# EAGLE design Queen Schematic Headers 2 (EAGLE 8.6.3)
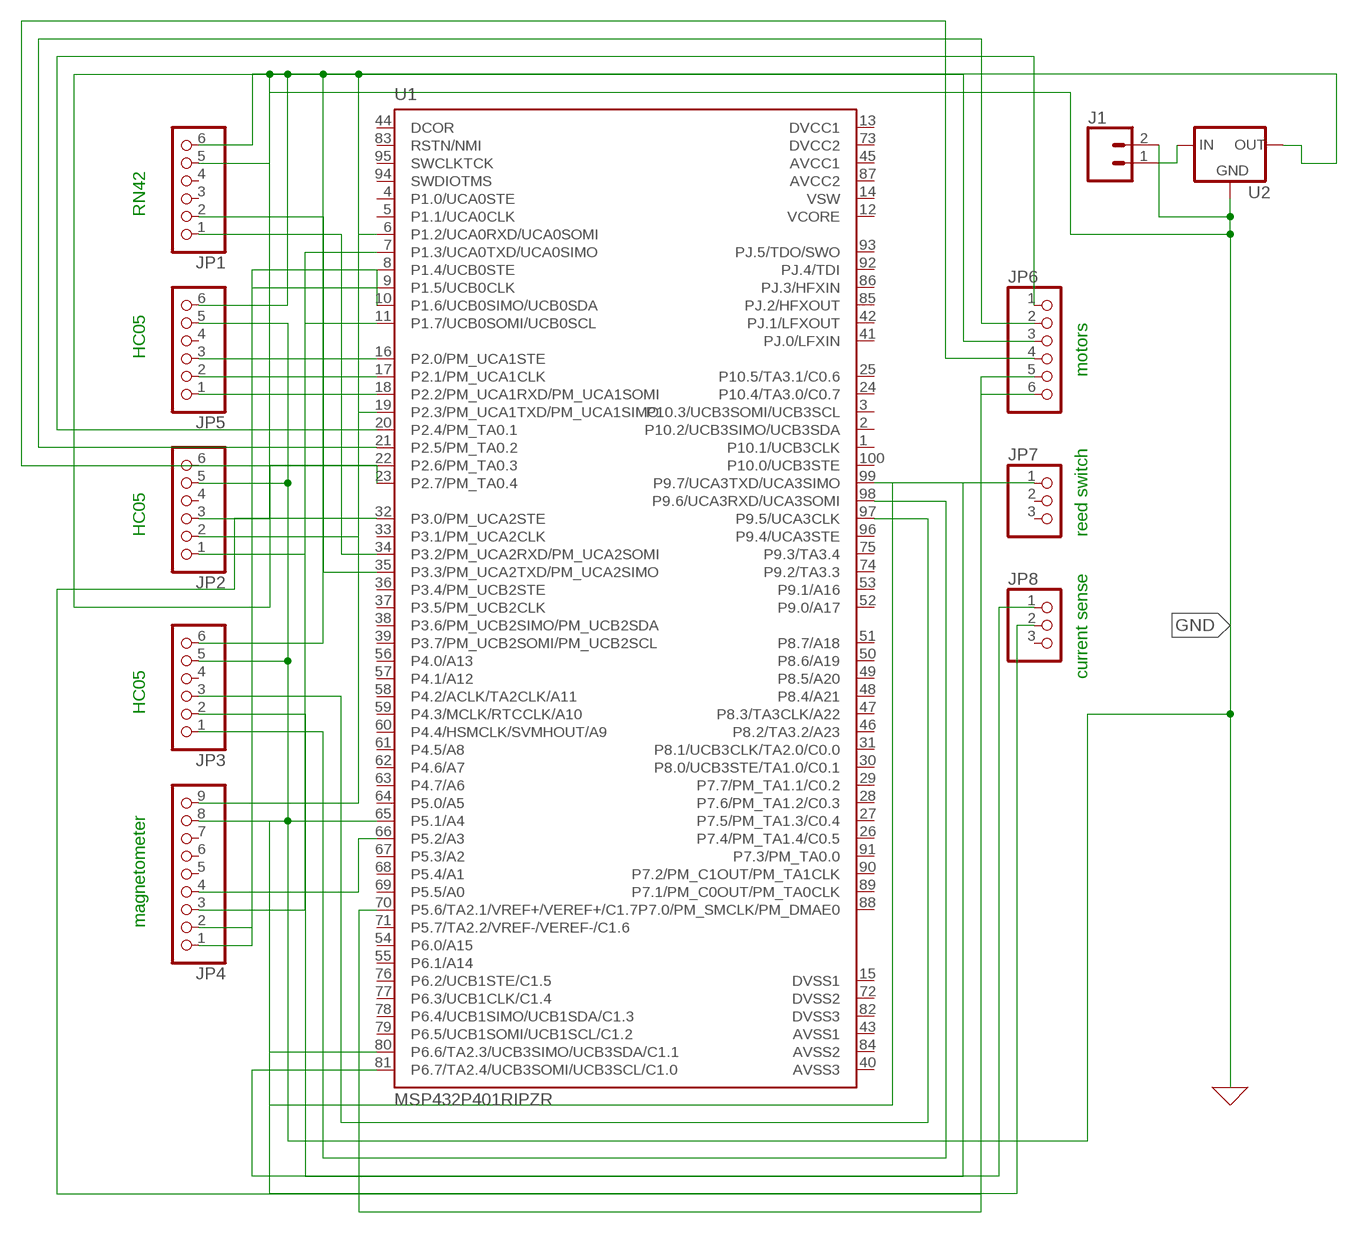
[diagram p0: schematic, sheet 1]

## Parts
J1  CONN_025MM  [SCREWTERMINAL-5MM-2]
JP1  PINHD-1X6  [1X06]
JP2  PINHD-1X6  [1X06]
JP3  PINHD-1X6  [1X06]
JP4  PINHD-1X9  [1X09-BIG]
JP5  PINHD-1X6  [1X06]
JP6  PINHD-1X6  [1X06]
JP7  PINHD-1X3  [1X03]
JP8  PINHD-1X3  [1X03]
U1  MSP432P401RIPZR  [QFP50P1600X1600X160-100N]
U2  V_REG_78XXSINK  [TO220-IGO]

## Nets
GND: J1.2 JP1.5 JP2.5 JP3.5 JP4.8 JP5.5 U2.GND
N$1: JP1.6 JP2.6 JP3.6 JP4.9 JP5.6 U2.OUT
N$2: JP1.1 U1.34(P3.2/PM_UCA2RXD/PM_UCA2SOMI)
N$3: JP1.2 U1.35(P3.3/PM_UCA2TXD/PM_UCA2SIMO)
N$4: JP3.2 U1.99(P9.7/UCA3TXD/UCA3SIMO)
N$5: JP5.1 U1.6(P1.2/UCA0RXD/UCA0SOMI)
N$6: JP5.2 U1.7(P1.3/UCA0TXD/UCA0SIMO)
N$7: JP5.3 U1.16(P2.0/PM_UCA1STE)
N$8: JP3.3 U1.97(P9.5/UCA3CLK)
N$9: JP2.1 U1.18(P2.2/PM_UCA1RXD/PM_UCA1SOMI)
N$10: JP2.2 U1.19(P2.3/PM_UCA1TXD/PM_UCA1SIMO)
N$11: JP2.3 U1.17(P2.1/PM_UCA1CLK)
N$12: JP4.1 U1.9(P1.5/UCB0CLK)
N$13: JP3.1 U1.98(P9.6/UCA3RXD/UCA3SOMI)
N$14: JP4.2 U1.10(P1.6/UCB0SIMO/UCB0SDA)
N$15: JP4.3 U1.11(P1.7/UCB0SOMI/UCB0SCL)
N$16: JP4.4 U1.66(P5.2/A3)
N$17: JP6.1 U1.20(P2.4/PM_TA0.1)
N$18: J1.1 U2.IN
N$19: JP6.2 U1.21(P2.5/PM_TA0.2)
N$20: JP6.3 U1.22(P2.6/PM_TA0.3)
N$21: JP6.4 U1.23(P2.7/PM_TA0.4)
N$22: JP6.5 U1.32(P3.0/PM_UCA2STE)
N$23: JP6.6 U1.70(P5.6/TA2.1/VREF+/VEREF+/C1.7)
N$24: JP7.1 U1.80(P6.6/TA2.3/UCB3SIMO/UCB3SDA/C1.1)
N$25: JP8.1 U1.81(P6.7/TA2.4/UCB3SOMI/UCB3SCL/C1.0)
N$26: JP8.2 U1.65(P5.1/A4)
Unconnected: JP1.3 JP1.4 JP2.4 JP3.4 JP4.5 JP4.6 JP4.7 JP5.4 JP7.2 JP7.3 JP8.3 U1.1(P10.1/UCB3CLK) U1.2(P10.2/UCB3SIMO/UCB3SDA) U1.3(P10.3/UCB3SOMI/UCB3SCL) U1.4(P1.0/UCA0STE) U1.5(P1.1/UCA0CLK) U1.8(P1.4/UCB0STE) U1.24(P10.4/TA3.0/C0.7) U1.25(P10.5/TA3.1/C0.6) U1.26(P7.4/PM_TA1.4/C0.5) U1.27(P7.5/PM_TA1.3/C0.4) U1.28(P7.6/PM_TA1.2/C0.3) U1.29(P7.7/PM_TA1.1/C0.2) U1.30(P8.0/UCB3STE/TA1.0/C0.1) U1.31(P8.1/UCB3CLK/TA2.0/C0.0) U1.33(P3.1/PM_UCA2CLK) U1.36(P3.4/PM_UCB2STE) U1.37(P3.5/PM_UCB2CLK) U1.38(P3.6/PM_UCB2SIMO/PM_UCB2SDA) U1.39(P3.7/PM_UCB2SOMI/PM_UCB2SCL) U1.41(PJ.0/LFXIN) U1.42(PJ.1/LFXOUT) U1.44(DCOR) U1.46(P8.2/TA3.2/A23) U1.47(P8.3/TA3CLK/A22) U1.48(P8.4/A21) U1.49(P8.5/A20) U1.50(P8.6/A19) U1.51(P8.7/A18) U1.52(P9.0/A17) U1.53(P9.1/A16) U1.54(P6.0/A15) U1.55(P6.1/A14) U1.56(P4.0/A13) U1.57(P4.1/A12) U1.58(P4.2/ACLK/TA2CLK/A11) U1.59(P4.3/MCLK/RTCCLK/A10) U1.60(P4.4/HSMCLK/SVMHOUT/A9) U1.61(P4.5/A8) U1.62(P4.6/A7) U1.63(P4.7/A6) U1.64(P5.0/A5) U1.67(P5.3/A2) U1.68(P5.4/A1) U1.69(P5.5/A0) U1.71(P5.7/TA2.2/VREF-/VEREF-/C1.6) U1.74(P9.2/TA3.3) U1.75(P9.3/TA3.4) U1.76(P6.2/UCB1STE/C1.5) U1.77(P6.3/UCB1CLK/C1.4) U1.78(P6.4/UCB1SIMO/UCB1SDA/C1.3) U1.79(P6.5/UCB1SOMI/UCB1SCL/C1.2) U1.83(RSTN/NMI) U1.85(PJ.2/HFXOUT) U1.86(PJ.3/HFXIN) U1.88(P7.0/PM_SMCLK/PM_DMAE0) U1.89(P7.1/PM_C0OUT/PM_TA0CLK) U1.90(P7.2/PM_C1OUT/PM_TA1CLK) U1.91(P7.3/PM_TA0.0) U1.92(PJ.4/TDI) U1.93(PJ.5/TDO/SWO) U1.94(SWDIOTMS) U1.95(SWCLKTCK) U1.96(P9.4/UCA3STE) U1.100(P10.0/UCB3STE)

## Notes on the sheet
- RN42
- HC05
- motors
- HC05 | reed switch
- current sense
- HC05
- magnetometer

## Power pins joined to a net without a drawn wire
AVCC1: U1.45(AVCC1)
AVCC2: U1.87(AVCC2)
AVSS1: U1.43(AVSS1)
AVSS2: U1.84(AVSS2)
AVSS3: U1.40(AVSS3)
DVCC1: U1.13(DVCC1)
DVCC2: U1.73(DVCC2)
DVSS1: U1.15(DVSS1)
DVSS2: U1.72(DVSS2)
DVSS3: U1.82(DVSS3)
VCORE: U1.12(VCORE)
VSW: U1.14(VSW)

## Library data of the parts
J1 = SparkFun-Connectors:CONN_02: Multi connection point. Often used as Generic Header-pin footprint for 0.1 inch spaced/style header connections On any of the 0.1 inch spaced packages, you can populate with these: Break Away Headers - Straight <https://www.sparkfun.com/products/116> (PRT-00116) Break Away Male Headers - Right Angle <https://www.sparkfun.com/products/553> (PRT-00553) Female Headers <https://www.sparkfun.com/products/115> (PRT-00115) Break Away Headers - Machine Pin <https://www.sparkfun.com/products/117> (PRT-00117) Break Away Female Headers - Swiss Machine Pin <https://www.sparkfun.com/products/743> (PRT-00743) For SCREWTERMINALS and SPRING TERMINALS visit here: Screw Terimnals on SparkFun.com <https://www.sparkfun.com/search/results?term=Screw+Terminals> (5mm/3.5mm/2.54mm spacing) This device is also useful as a general connection point to wire up your design to another part of your project. Our various solder wires solder well into these plated through hole pads. Hook-Up Wire - Assortment (Stranded, 22 AWG) <https://www.sparkfun.com/products/11375> (PRT-11375) Hook-Up Wire - Assortment (Solid Core, 22 AWG) <https://www.sparkfun.com/products/11367> (PRT-11367) View the entire wire category on our website here <https://www.sparkfun.com/categories/141> Special notes: Molex polarized connector foot print use with: PRT-08233 with associated crimp pins and housings. 2.54_SCREWTERM for use with PRT-10571. 3.5mm Screw Terminal footprints for PRT-08084 5mm Screw Terminal footprints for use with PRT-08432; SF_SKU: PRT-08432
JP1-JP3 JP5 JP6 = adafruit:PINHD-1X6: PIN HEADER
JP4 = adafruit:PINHD-1X9: Pin header 1x10 0.1" spacing With round pins
JP7 JP8 = adafruit:PINHD-1X3: PIN HEADER
U1 = MSP432P401RIPZR:MSP432P401RIPZR: Low-Power and High Performance 32-Bit ARM Cortex M4F With 256KB Flash and 64KB RAM 100-LQFP -40 to 85; AVAILABILITY: Good; DESCRIPTION: Low-Power and High Performance 32-Bit ARM Cortex M4F With 256KB Flash and 64KB RAM 100-LQFP -40 to 85; MF: Texas Instruments; MP: MSP432P401RIPZR; PACKAGE: LQFP-100 Texas Instruments; PRICE: 5.54 USD
U2 = SparkFun-IC-Power:V_REG_78XX: Voltage Regulator Standard 78xx regulator. IGO (Input Ground Output). Spark Fun Electronics SKU : COM-00107

## Board
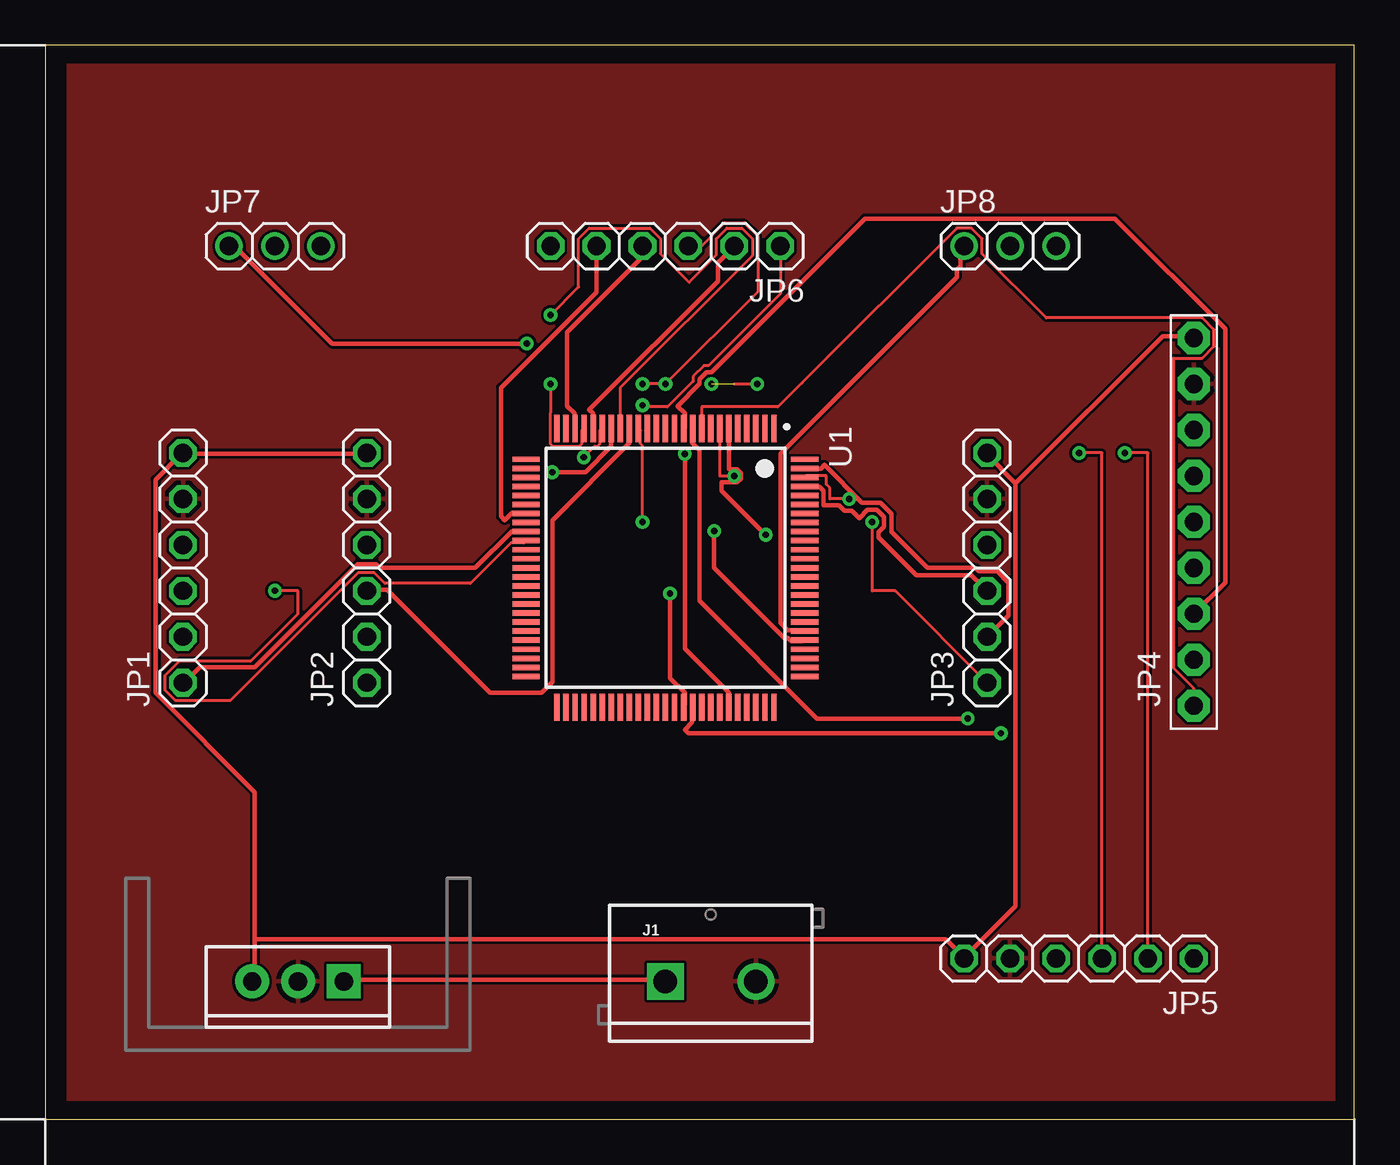
[diagram p1: board, top side]
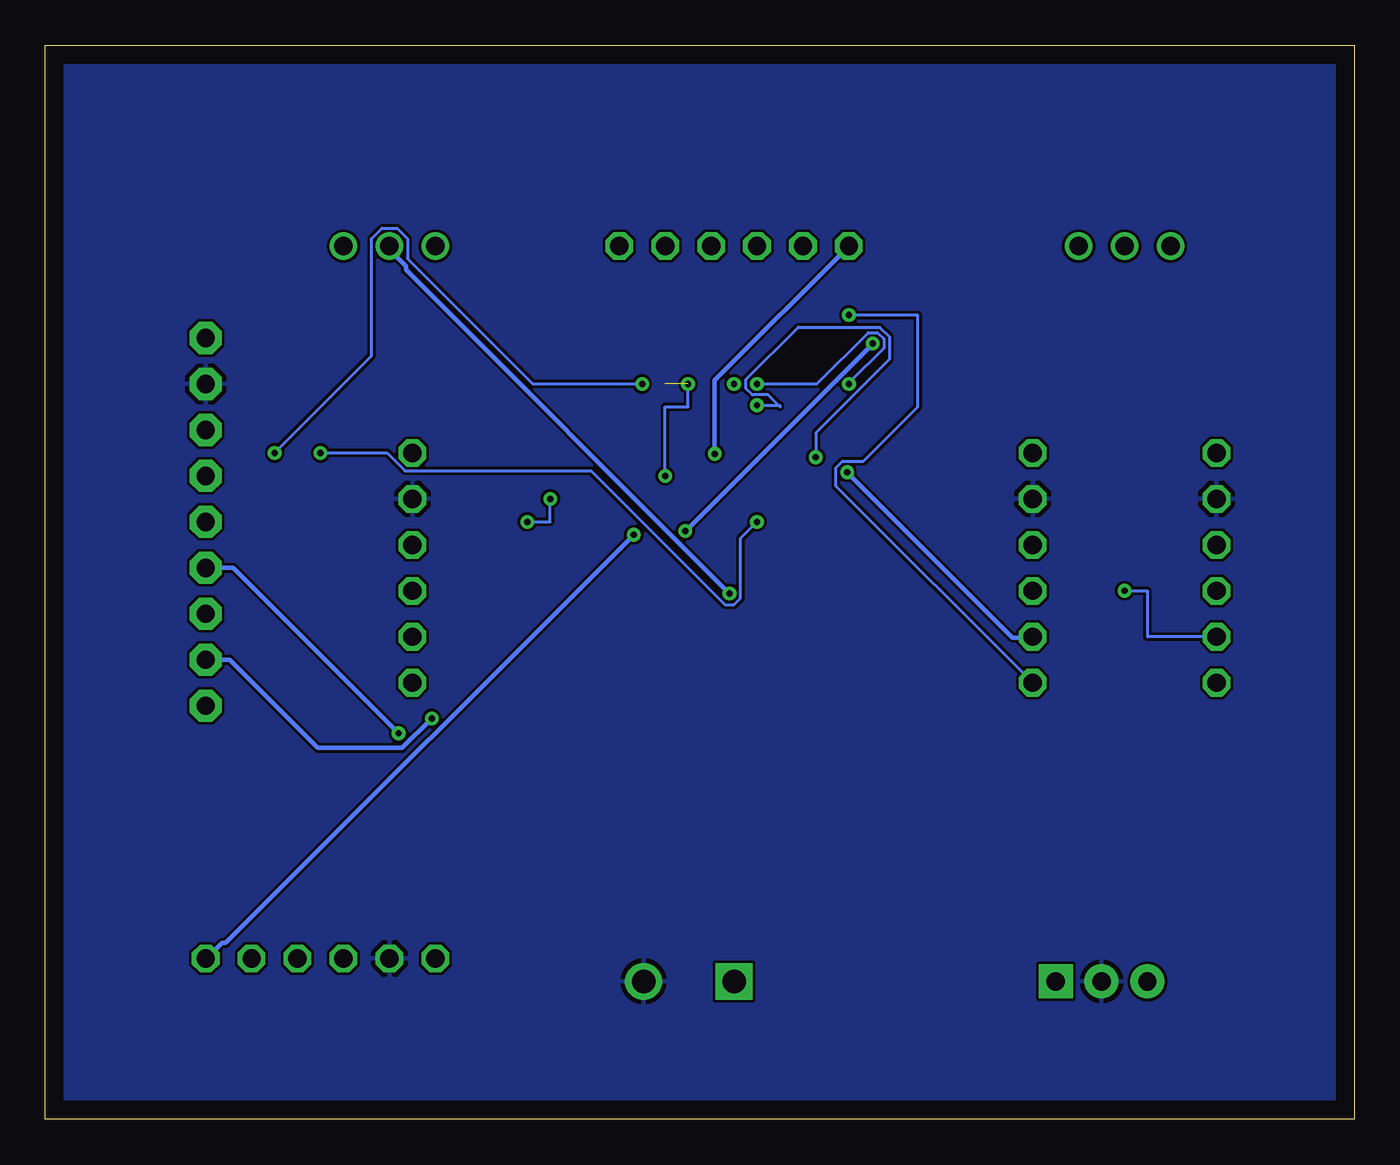
[diagram p2: board, bottom side, seen from below]

Size 72.37 x 59.36 mm. Coordinates in mm from the lower left corner, seen from the top.
Outline: 0,0 72.37,0 72.37,59.36 0,59.36 0,0
Copper layers (1*16): Top 0.035mm / dielectric 1.5mm / Bottom 0.035mm
Design rules "default *": minimum track width 10mil, minimum drill 0.35mm, track to track 6mil, track to pad 6mil, pad to pad 6mil, via to via 6mil, smd to smd 6mil, copper to edge 40mil, drill to drill 6mil, minimum pad ring 10mil, minimum via ring 8mil, stop-mask expansion 4mil, vias tented up to drill 0mil, thermal gap 10mil

### Footprints (pad centres in the part's own frame; a part is rotated, then mirrored left to right if it is on the bottom)
SCREWTERMINAL-5MM-2 = drill 1.3 pad 2.032 square: 1 0,0 | drill 1.3 pad 2.032: 2 5,0
1X06 = drill 1.016 octagon: 1 -6.35,0; 2 -3.81,0; 3 -1.27,0; 4 1.27,0; 5 3.81,0; 6 6.35,0
1X09-BIG = drill 1.016 pad 1.778 octagon: 1 -10.16,0; 2 -7.62,0; 3 -5.08,0; 4 -2.54,0; 5 0,0; 6 2.54,0; 7 5.08,0; 8 7.62,0; 9 10.16,0
1X03 = drill 1.016: 1 -2.54,0; 2 0,0; 3 2.54,0
QFP50P1600X1600X160-100N = smd 1.5 x 0.3: 1 -7.7,6; 2 -7.7,5.5; 3 -7.7,5; 4 -7.7,4.5; 5 -7.7,4; 6 -7.7,3.5; 7 -7.7,3; 8 -7.7,2.5; 9 -7.7,2; 10 -7.7,1.5; 11 -7.7,1; 12 -7.7,0.5; 13 -7.7,0; 14 -7.7,-0.5; 15 -7.7,-1; 16 -7.7,-1.5; 17 -7.7,-2; 18 -7.7,-2.5; 19 -7.7,-3; 20 -7.7,-3.5; 21 -7.7,-4; 22 -7.7,-4.5; 23 -7.7,-5; 24 -7.7,-5.5; 25 -7.7,-6; 51 7.7,-6; 52 7.7,-5.5; 53 7.7,-5; 54 7.7,-4.5; 55 7.7,-4; 56 7.7,-3.5; 57 7.7,-3; 58 7.7,-2.5; 59 7.7,-2; 60 7.7,-1.5; 61 7.7,-1; 62 7.7,-0.5; 63 7.7,0; 64 7.7,0.5; 65 7.7,1; 66 7.7,1.5; 67 7.7,2; 68 7.7,2.5; 69 7.7,3; 70 7.7,3.5; 71 7.7,4; 72 7.7,4.5; 73 7.7,5; 74 7.7,5.5; 75 7.7,6 | smd 0.3 x 1.5: 26 -6,-7.7; 27 -5.5,-7.7; 28 -5,-7.7; 29 -4.5,-7.7; 30 -4,-7.7; 31 -3.5,-7.7; 32 -3,-7.7; 33 -2.5,-7.7; 34 -2,-7.7; 35 -1.5,-7.7; 36 -1,-7.7; 37 -0.5,-7.7; 38 0,-7.7; 39 0.5,-7.7; 40 1,-7.7; 41 1.5,-7.7; 42 2,-7.7; 43 2.5,-7.7; 44 3,-7.7; 45 3.5,-7.7; 46 4,-7.7; 47 4.5,-7.7; 48 5,-7.7; 49 5.5,-7.7; 50 6,-7.7; 76 6,7.7; 77 5.5,7.7; 78 5,7.7; 79 4.5,7.7; 80 4,7.7; 81 3.5,7.7; 82 3,7.7; 83 2.5,7.7; 84 2,7.7; 85 1.5,7.7; 86 1,7.7; 87 0.5,7.7; 88 0,7.7; 89 -0.5,7.7; 90 -1,7.7; 91 -1.5,7.7; 92 -2,7.7; 93 -2.5,7.7; 94 -3,7.7; 95 -3.5,7.7; 96 -4,7.7; 97 -4.5,7.7; 98 -5,7.7; 99 -5.5,7.7; 100 -6,7.7
TO220-IGO = drill 1 pad 1.88: GND 0,0; OUT 2.54,0 | drill 1 pad 1.88 square: IN -2.54,0

### Placement (x,y rotation side)
J1  34.29,7.62 0 top
JP1  7.62,30.48 90 top
JP2  17.78,30.48 90 top
JP3  52.07,30.48 90 top
JP4  63.5,33.02 90 top
JP5  57.15,8.89 180 top
JP6  34.29,48.26 180 top
JP7  12.7,48.26 0 top
JP8  53.34,48.26 0 top
U1  34.29,30.48 270 top
U2  13.97,7.62 180 top

### Tracks (layer width: path | path; a pad name or v marks a point on that pad's centre or on a via)
GND
  pour Bottom: 0,59.69 72.39,59.69 72.39,0 0,0
  pour Bottom: 1.27,59.69 73.66,59.69 73.66,0 1.27,0
  pour Top: 1.27,59.69 73.66,59.69 73.66,0 1.27,0
N$1
  Top 0.254: JP2.6 17.68,36.78 7.72,36.78 JP1.6 7.52,36.78 6.1,35.36 6.1,23.57 11.58,18.09 11.58,9.96 | 11.58,9.96 11.58,7.72 U2.OUT | 50.8,8.94 53.65,11.79 53.65,35.15 | 53.65,35.15 52.02,36.78 JP3.6 | 53.65,35.15 61.77,43.28 63.4,43.28 JP4.9 | 11.58,9.96 49.78,9.96 50.8,8.94 | 50.8,8.94 JP5.6
N$2
  Top 0.254: U1.34 26.42,32.51 25.81,32.51 23.77,30.48 18.49,30.48 18.29,30.68 17.27,30.68 11.58,24.99 8.53,24.99 7.72,24.18 JP1.1
N$3  (via drill 0.35)
  Top 0.152: U1.35 26.47,31.86 25.75,31.86 23.5,29.62 18.77,29.62 18.19,30.2 17.29,30.2 10.23,23.14 7.21,23.14 6.63,23.72 6.63,24.54 7.44,25.35 11.38,25.35 13.97,27.94 13.97,29.21 v12.7,29.21
  Bottom 0.152: JP1.2 11.43,26.67 11.43,29.21 v12.7,29.21
N$4
  Top 0.254: JP3.2 53.24,27.84 53.24,29.67 52.63,30.28 51.61,30.28 51.41,30.48 48.77,30.48 46.78,32.46 46.78,33.46 46.16,34.08 45.16,34.08 43.08,36.17 42.88,35.97 42.06,35.97 U1.99
N$5  (via drill 0.35)
  Top 0.254: v39.83,32.31 37.39,34.75 37.39,35.2 38.25,35.2 38.46,35.41 38.46,35.71 38.25,35.92 37.8,35.92 37.8,38 U1.6
  Bottom 0.254: v39.83,32.31 62.38,9.75 62.59,9.75 63.4,8.94 JP5.1
N$6  (via drill 0.35)  (1 unrouted)
  Top 0.152: JP5.2 60.96,36.83 v59.69,36.83 | 38.1,40.64 v39.37,40.64 | U1.7 37.29,35.56 v38.1,35.56
  Bottom 0.152: v59.69,36.83 54.33,42.19 54.33,48.67 53.75,49.25 52.93,49.25 52.35,48.67 52.35,47.57 45.42,40.64 v39.37,40.64 | v38.1,35.56 38.1,39.37 36.83,39.37 v36.83,40.64
N$7  (via drill 0.35)
  Top 0.152: JP5.3 58.42,36.83 v57.15,36.83 | v33.02,33.02 33.02,37.23 32.91,37.34 32.91,38.06 U1.16
  Bottom 0.152: v57.15,36.83 53.47,36.83 52.48,35.84 42.18,35.84 34.8,28.45 34.29,28.45 33.94,28.81 33.94,32.1 v33.02,33.02
N$8
  Top 0.254: JP3.3 51.21,30.07 48.16,30.07 46.08,32.16 46.08,32.45 46.38,32.75 46.38,33.29 45.99,33.68 45.45,33.68 45,33.23 44.6,33.63 44.18,33.63 43.88,33.93 43.03,33.93 43.02,33.95 43.02,34.75 42.81,34.95 42.06,34.95 U1.97
N$9  (via drill 0.35)
  Top 0.152: U1.18 31.79,40.43 39.09,47.73 39.09,48.67 38.51,49.25 37.69,49.25 37.11,48.67 37.11,47.77 35.6,46.26 34.01,47.85 34.01,48.67 33.43,49.25 30.07,49.25 29.49,48.67 29.49,46 v27.94,44.45
  Bottom 0.152: JP2.1 28.65,35 28.65,36.02 28.29,36.37 27.13,36.37 24.13,39.37 24.13,44.45 v27.94,44.45
N$10  (via drill 0.35)
  Top 0.254: v28.04,35.76 29.87,35.76 31.29,37.19 31.29,38 U1.19
  Bottom 0.254: v28.04,35.76 18.9,26.62 17.88,26.62 JP2.2
N$11
  Top 0.254: U1.17 32.31,38 32.31,37.39 28.04,33.12 28.04,24.18 27.43,23.57 24.59,23.57 18.9,29.26 17.88,29.26 JP2.3
N$12
  Top 0.152: JP4.1 63.5,23.82 62.38,24.94 62.38,42.06 63.96,42.06 64.62,42.72 64.62,43.64 63.96,44.3 55.34,44.3 51.79,47.85 51.79,48.67 51.21,49.25 50.39,49.25 41.84,40.7 | 41.84,40.7 40.51,39.37 36.29,39.37 U1.9 | 41.84,40.7
N$13  (via drill 0.35)
  Top 0.152: JP3.1 46.99,29.21 45.72,29.21 v45.72,33.02 | v44.45,34.29 43.38,34.29 43.38,34.89 43.18,35.09 43.18,35.56 42.07,35.56 U1.98
  Bottom 0.152: v45.72,33.02 44.45,33.02 v44.45,34.29
N$14  (via drill 0.35)
  Top 0.254: v51,22.15 42.67,22.15 36.17,28.65 36.17,36.98 35.76,37.39 35.76,38 U1.10
  Bottom 0.254: v51,22.15 52.63,20.52 57.3,20.52 62.18,25.4 JP4.2
N$15
  Top 0.254: JP4.3 65.23,29.67 65.23,43.69 59.13,49.78 45.31,49.78 36.83,41.3 36.56,41.3 36.17,40.91 36.17,40.64 34.95,39.42 35.36,39.01 35.36,38.2 U1.11
N$16  (via drill 0.35)
  Top 0.254: v52.83,21.34 35.56,21.34 35.36,21.54 35.76,21.95 35.76,22.76 U1.66
  Bottom 0.254: v52.83,21.34 61.98,30.48 JP4.4
N$17  (via drill 0.35)
  Top 0.152: JP6.1 40.64,45.61 36.68,41.65 36.41,41.65 35.82,41.06 35.82,40.79 34.4,39.37 33.02,39.37 v33.02,39.46 | U1.20 30.67,38.06 30.67,37.34 30.54,37.2 30.38,37.2 v29.77,36.59
  Bottom 0.152: v33.02,39.46 31.75,39.46 31.75,39.37 32.41,40.03 33.27,40.03 33.63,40.39 33.63,40.89 30.73,43.79 26.24,43.79 25.71,43.25 25.71,42 29.77,37.93 v29.77,36.59
N$18
  Top 0.254: U2.IN 16.66,7.72 34.14,7.72 J1.1
N$19
  Top 0.254: JP6.2 37.19,47.35 37.19,46.33 30.07,39.22 30.28,39.01 30.28,38.2 U1.21
N$20  (via drill 0.35)
  Top 0.152: JP6.3 36.27,48.26 37.56,49.55 38.64,49.55 39.4,48.8 39.4,45.74 v34.29,40.64 v33.02,40.64 | v27.93,40.63 27.93,39.05 27.91,39.02 27.91,37.34 28.05,37.2 29.54,37.2 29.67,37.34 29.67,38.06 U1.22
  Bottom 0.152: v33.02,40.64 29.71,40.64 26.87,43.48 26.37,43.48 26.01,43.13 26.01,42.62 27.94,40.7 v27.94,40.63 v27.93,40.63
N$21
  Top 0.254: U1.23 29.26,38.2 29.26,39.01 28.85,39.42 28.85,43.48 32.92,47.55 32.92,48.16 JP6.4
N$22
  Top 0.254: JP6.5 30.48,45.72 25.2,40.44 25.2,33.33 25.4,33.12 25.81,33.53 26.42,33.53 U1.32
N$23  (via drill 0.35)
  Top 0.254: v35.36,36.78 35.36,26.01 37.8,23.57 37.8,22.96 U1.70
  Bottom 0.254: v35.36,36.78 35.36,40.84 JP6.6
N$24  (via drill 0.35)
  Top 0.254: v36.98,32.51 36.98,30.48 40.84,26.62 41.05,26.62 41.25,26.42 41.86,26.42 U1.80 | v26.62,42.88 15.85,42.88 10.57,48.16 10.16,48.16 JP7.1
  Bottom 0.254: v26.62,42.88 v36.98,32.51
N$25
  Top 0.254: U1.81 41.86,27.03 41.05,27.03 40.64,27.43 40.64,36.78 50.39,46.53 50.39,46.94 50.6,47.14 50.6,47.95 50.8,48.16 JP8.1
N$26  (via drill 0.35)
  Top 0.254: v34.54,29.06 34.54,24.38 35.36,23.57 35.36,22.96 U1.65
  Bottom 0.254: v34.54,29.06 52.43,46.94 52.43,47.14 53.44,48.16 JP8.2